# Altium schematic sheet ItopTest.SchDoc
size A2
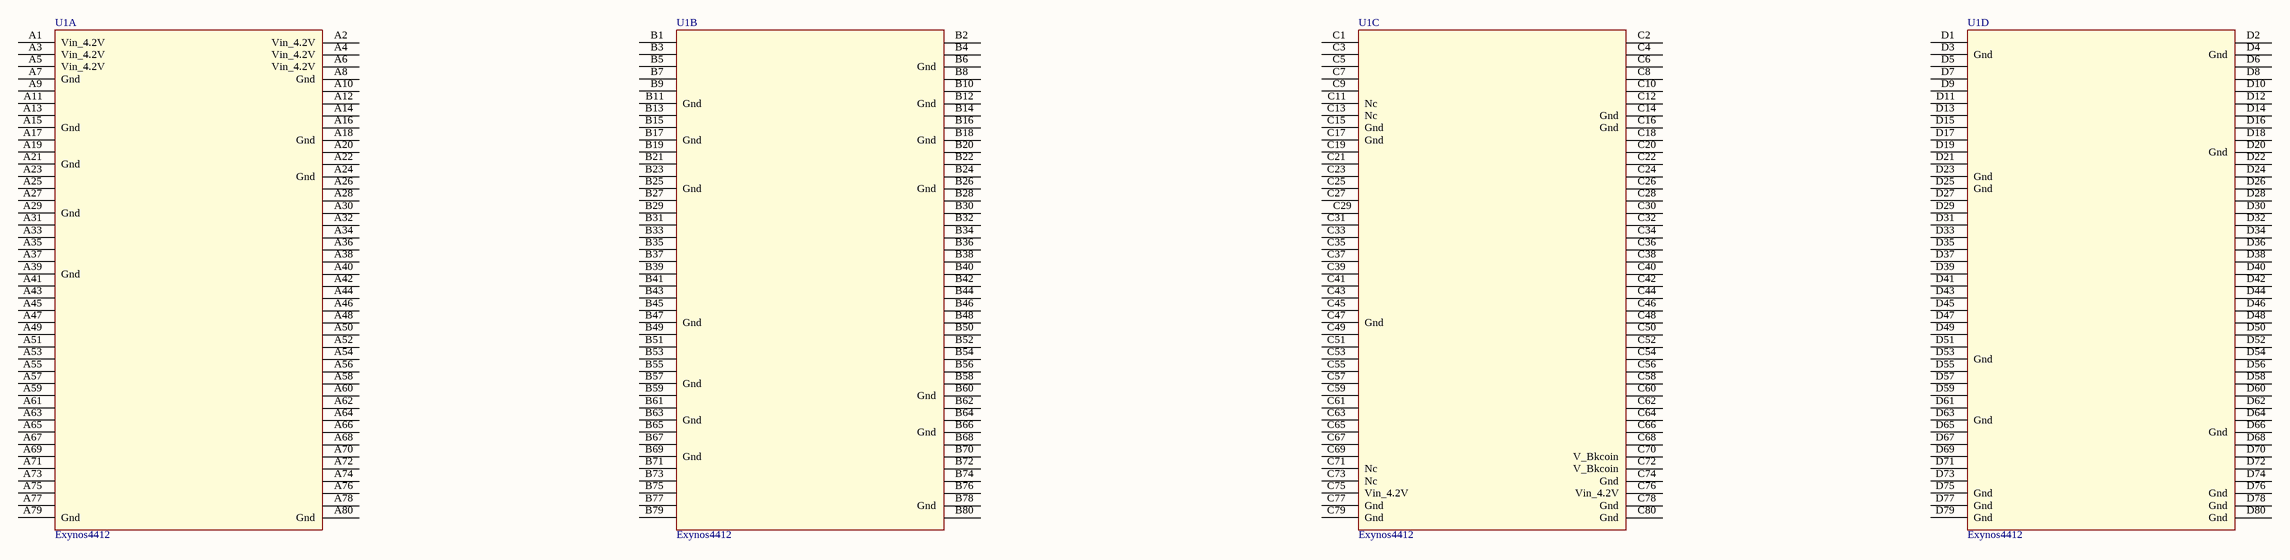
[diagram p0: ItopTest.SchDoc]

## Parts
U1  Exynos4412  [Exynos4412]  (parts A,B,C,D of 4)

## Nets

Not connected (* = marked no-connect by the designer): U1 A1(Vin_4.2V) A2(Vin_4.2V) A3(Vin_4.2V) A4(Vin_4.2V) A5(Vin_4.2V) A6(Vin_4.2V) A7(Gnd) A8(Gnd) A9 A10 A11 A12 A13 A14 A15(Gnd) A16 A17 A18(Gnd) A19 A20 A21(Gnd) A22 A23 A24(Gnd) A25 A26 A27 A28 A29(Gnd) A30 A31 A32 A33 A34 A35 A36 A37 A38 A39(Gnd) A40 A41 A42 A43 A44 A45 A46 A47 A48 A49 A50 A51 A52 A53 A54 A55 A56 A57 A58 A59 A60 A61 A62 A63 A64 A65 A66 A67 A68 A69 A70 A71 A72 A73 A74 A75 A76 A77 A78 A79(Gnd) A80(Gnd) B1 B2 B3 B4 B5 B6(Gnd) B7 B8 B9 B10 B11(Gnd) B12(Gnd) B13 B14 B15 B16 B17(Gnd) B18(Gnd) B19 B20 B21 B22 B23 B24 B25(Gnd) B26(Gnd) B27 B28 B29 B30 B31 B32 B33 B34 B35 B36 B37 B38 B39 B40 B41 B42 B43 B44 B45 B46 B47(Gnd) B48 B49 B50 B51 B52 B53 B54 B55 B56 B57(Gnd) B58 B59 B60(Gnd) B61 B62 B63(Gnd) B64 B65 B66(Gnd) B67 B68 B69(Gnd) B70 B71 B72 B73 B74 B75 B76 B77 B78(Gnd) B79 B80 C1 C2 C3 C4 C5 C6 C7 C8 C9 C10 C11(Nc) C12 C13(Nc) C14(Gnd) C15(Gnd) C16(Gnd) C17(Gnd) C18 C19 C20 C21 C22 C23 C24 C25 C26 C27 C28 C29 C30 C31 C32 C33 C34 C35 C36 C37 C38 C39 C40 C41 C42 C43 C44 C45 C46 C47(Gnd) C48 C49 C50 C51 C52 C53 C54 C55 C56 C57 C58 C59 C60 C61 C62 C63 C64 C65 C66 C67 C68 C69 C70(V_Bkcoin) C71(Nc) C72(V_Bkcoin) C73(Nc) C74(Gnd) C75(Vin_4.2V) C76(Vin_4.2V) C77(Gnd) C78(Gnd) C79(Gnd) C80(Gnd) D1 D2 D3(Gnd) D4(Gnd) D5 D6 D7 D8 D9 D10 D11 D12 D13 D14 D15 D16 D17 D18 D19 D20(Gnd) D21 D22 D23(Gnd) D24 D25(Gnd) D26 D27 D28 D29 D30 D31 D32 D33 D34 D35 D36 D37 D38 D39 D40 D41 D42 D43 D44 D45 D46 D47 D48 D49 D50 D51 D52 D53(Gnd) D54 D55 D56 D57 D58 D59 D60 D61 D62 D63(Gnd) D64 D65 D66(Gnd) D67 D68 D69 D70 D71 D72 D73 D74 D75(Gnd) D76(Gnd) D77(Gnd) D78(Gnd) D79(Gnd) D80(Gnd)

## Notes on the sheet
- Title
- Size:
- Date:
- File:
- A2
- Number:
- Time:
- Revision:
- Sheet
- of